# EAGLE design LL1540_tr (EAGLE 7.3.0)
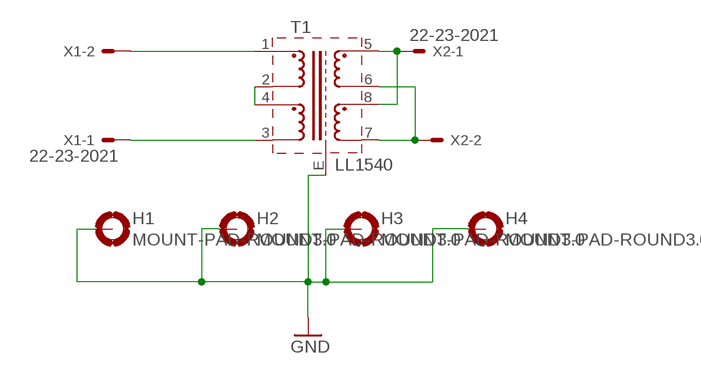
[diagram p0: schematic, sheet 1]

## Parts
H1  MOUNT-PAD-ROUND3.0  [3,0-PAD]
H2  MOUNT-PAD-ROUND3.0  [3,0-PAD]
H3  MOUNT-PAD-ROUND3.0  [3,0-PAD]
H4  MOUNT-PAD-ROUND3.0  [3,0-PAD]
T1  LL1540  [LL1540]
X1  22-23-2021  [22-23-2021]
X2  22-23-2021  [22-23-2021]

## Nets
GND: H1.B3,0(MOUNT) H2.B3,0(MOUNT) H3.B3,0(MOUNT) H4.B3,0(MOUNT) T1.E
N$1: T1.2 T1.4
N$2: T1.1 X1.2
N$3: T1.3 X1.1
N$4: T1.5 T1.8 X2.1
N$5: T1.6 T1.7 X2.2

## Library data of the parts
H1-H4 = holes:MOUNT-PAD-ROUND: MOUNTING PAD, round
T1 = lundahl:LL1540: LL1540 Transformer
X1 X2 = con-molex:22-23-2021: .100" (2.54mm) Center Header - 2 Pin; MF: MOLEX; MPN: 22-23-2021; OC_FARNELL: 1462926; OC_NEWARK: 25C3832

## Board
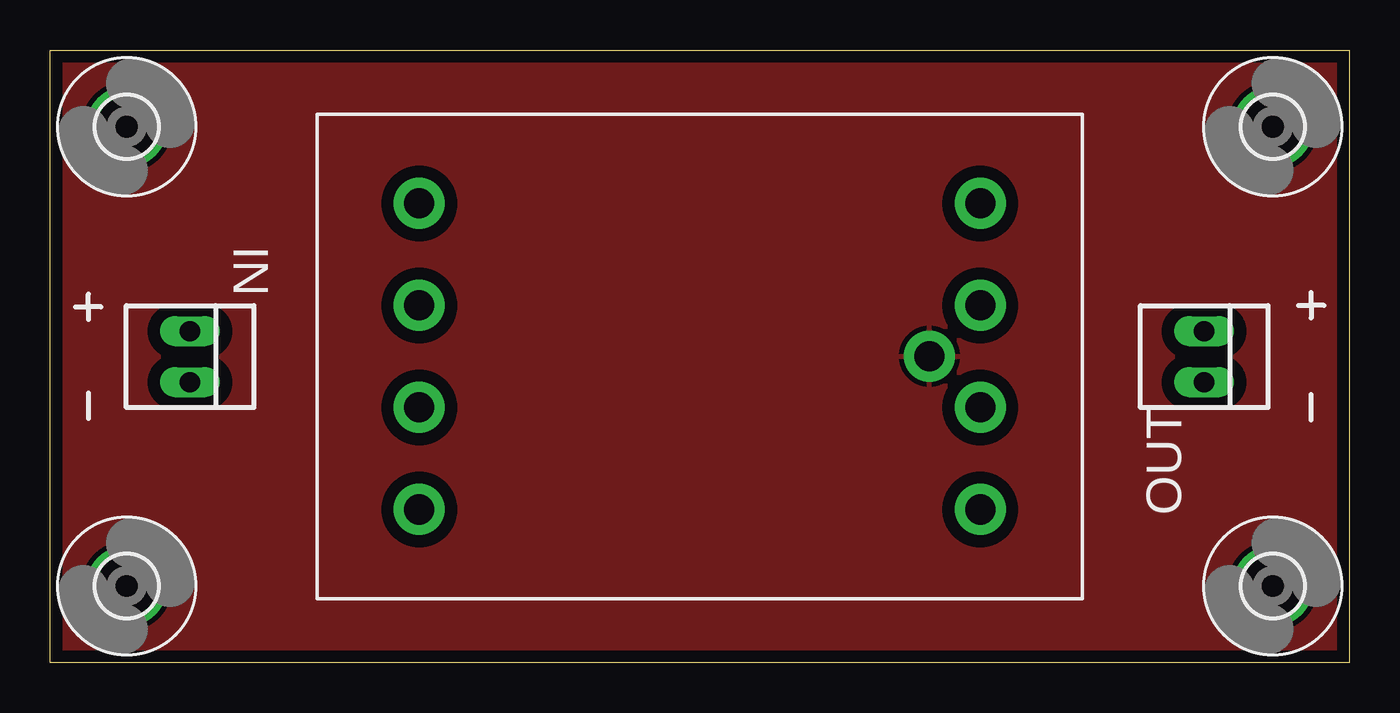
[diagram p1: board, top side]
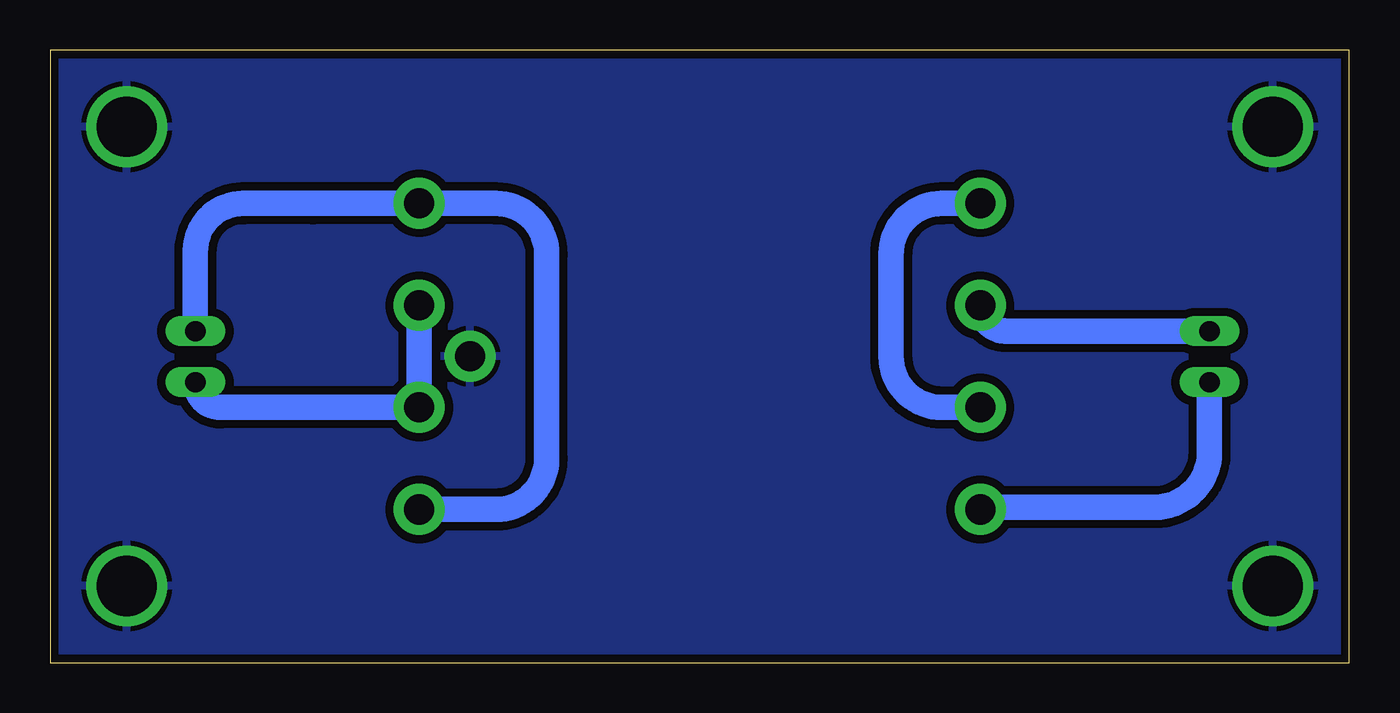
[diagram p2: board, bottom side, seen from below]

Size 64.69 x 30.48 mm. Coordinates in mm from the lower left corner, seen from the top.
Outline: 64.69,30.48 64.69,0 0,0 0,30.48 64.69,30.48
Copper layers (1*16): Top 0.0356mm / dielectric 1.5011mm / Bottom 0.0356mm
Design rules "oshpark-2layer": minimum track width 6mil, minimum drill 13mil, track to track 6mil, track to pad 6mil, pad to pad 6mil, via to via 6mil, smd to smd 6mil, copper to edge 15mil, drill to drill 6mil, minimum pad ring 7mil, minimum via ring 7mil, stop-mask expansion 2.5mil, vias tented up to drill 0mil, thermal gap 10mil

### Footprints (pad centres in the part's own frame; a part is rotated, then mirrored left to right if it is on the bottom)
3,0-PAD = drill 3 pad 3.81: B3,0 0,0
LL1540 = drill 1.5 pad 2.54: 1 -13.335,-7.62; 2 -13.335,-2.54; 3 -13.335,2.54; 4 -13.335,7.62; 5 14.605,-7.62; 6 14.605,-2.54; 7 14.605,2.54; 8 14.605,7.62; E 12.065,0
22-23-2021 = drill 1 long: 1 -1.27,0; 2 1.27,0

### Placement (x,y rotation side)
H1  3.81,3.81 0 top
H2  3.81,26.67 0 top
H3  60.88,26.67 0 top
H4  60.88,3.81 0 top
T1  31.71,15.24 0 top
X1  6.96,15.23 270 top
X2  57.46,15.23 270 top

### Tracks (layer width: path | path; a pad name or v marks a point on that pad's centre or on a via)
GND
  pour Top (isolate 0.61): 0,30.48 64.69,30.48 64.69,0 0,0
  pour Bottom (isolate 0.406): -0.04,30.48 64.71,30.48 64.71,-0.02 -0.04,-0.02
N$1
  Bottom 1.27: T1.4 20.28,22.86 arc-90 22.82,20.32 22.82,15.24 arc-90 20.28,12.7 T1.2
N$2
  Bottom 1.27: X1.2 6.96,10.48 arc90 9.71,7.73 18.27,7.73 arc-90 T1.1
N$3
  Bottom 1.27: T1.3 arc-90 17.1,16.5 X1.1
N$4
  Bottom 1.27: T1.5 42.51,7.62 arc-90 39.97,10.16 39.97,20.32 arc-90 42.51,22.86 T1.8 51.6,22.86 55.08,22.86 arc-90 57.46,20.48 X2.1
N$5
  Bottom 1.27: T1.7 T1.6 56.2,12.7 arc90 X2.2

### Text on the board
tNames: IN | OUT